# EAGLE design av_sync (EAGLE 5.11)
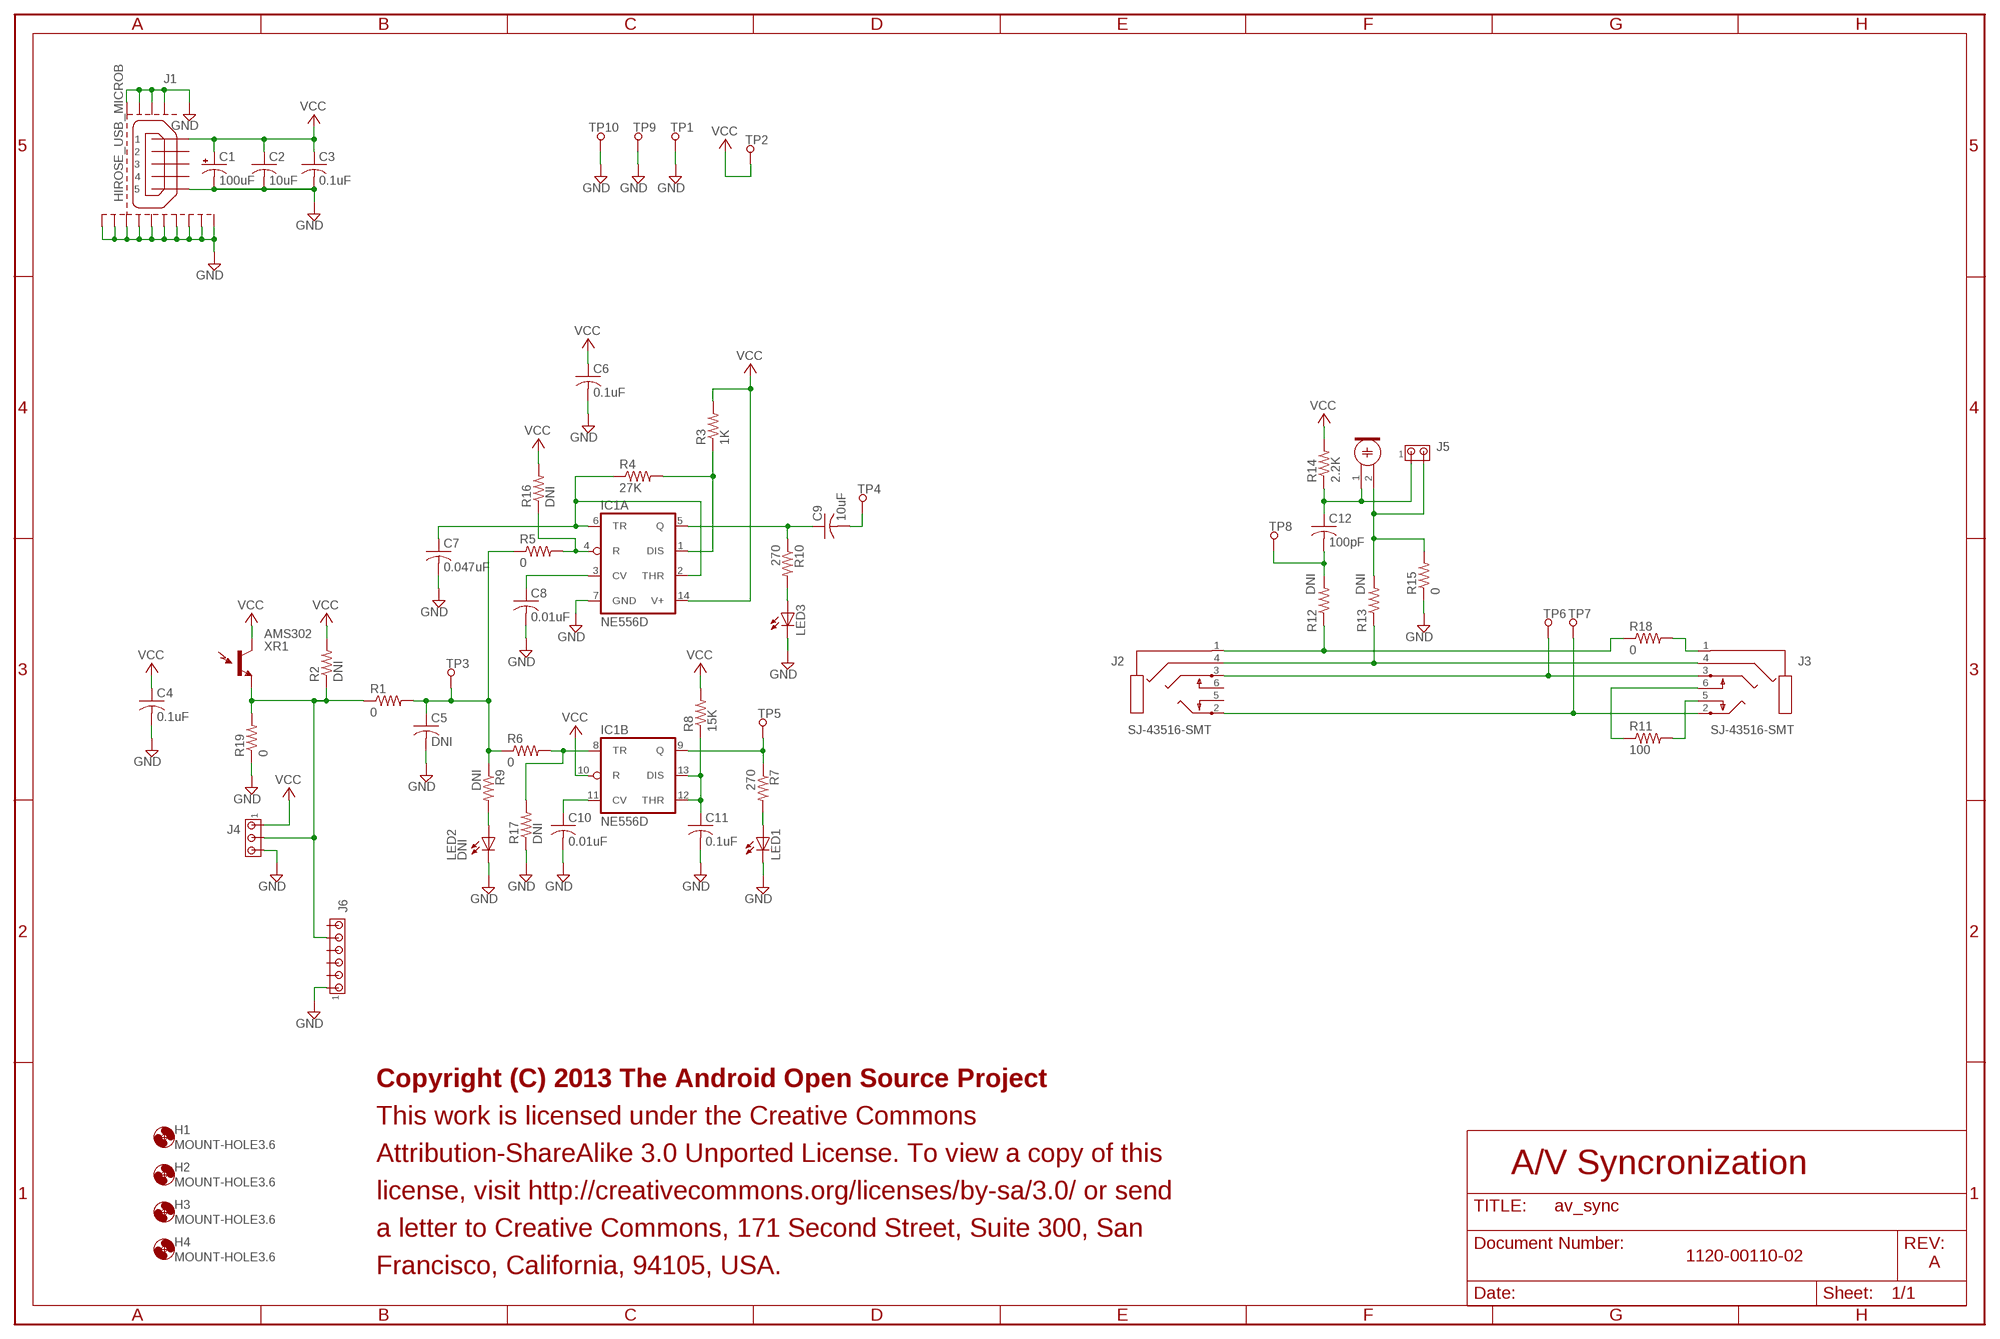
[diagram p0: schematic, sheet 1]

## Parts
C1  100uF  CPOL-USE2-5  [E2-5]
C2  10uF  C-US025-024X044  [C025-024X044]
C3  0.1uF  C-USC0805  [C0805]
C4  0.1uF  C-USC0805  [C0805]
C5  DNI  C-USC0805  [C0805]
C6  0.1uF  C-USC0805  [C0805]
C7  0.047uF  C-USC0805  [C0805]
C8  0.01uF  C-USC0805  [C0805]
C9  10uF  C-US025-024X044  [C025-024X044]
C10  0.01uF  C-USC0805  [C0805]
C11  0.1uF  C-USC0805  [C0805]
C12  100pF  C-USC0805  [C0805]
H1  MOUNT-HOLE3.6  [3,6]
H2  MOUNT-HOLE3.6  [3,6]
H3  MOUNT-HOLE3.6  [3,6]
H4  MOUNT-HOLE3.6  [3,6]
IC1  NE556D  [SO14]
J1  HIROSE_USB_MICROB  [HIROSE_ZX62D-B-5P8]
J2  SJ-43516-SMT  [SJ-4351X-SMT]
J3  SJ-43516-SMT  [SJ-4351X-SMT]
J4  MTA03-100  [10X03MTA]
J5  MTA02-100  [10X02MTA]
J6  MTA06-100  [10X06MTA]
LED1  LED5MM  [LED5MM]
LED2  DNI  LED5MM  [LED5MM]
LED3  LED5MM  [LED5MM]
M1  ELECTRET_MICROPHON-F6035AP  [F6035AP]
R1  0  R-US_R0805  [R0805]
R2  DNI  R-US_R0805  [R0805]
R3  1K  R-US_R0805  [R0805]
R4  27K  R-US_R0805  [R0805]
R5  0  R-US_R0805  [R0805]
R6  0  R-US_R0805  [R0805]
R7  270  R-US_R0805  [R0805]
R8  15K  R-US_R0805  [R0805]
R9  DNI  R-US_R0805  [R0805]
R10  270  R-US_R0805  [R0805]
R11  100  R-US_R0805  [R0805]
R12  DNI  R-US_R0805  [R0805]
R13  DNI  R-US_R0805  [R0805]
R14  2.2K  R-US_R0805  [R0805]
R15  0  R-US_R0805  [R0805]
R16  DNI  R-US_R0805  [R0805]
R17  DNI  R-US_R0805  [R0805]
R18  0  R-US_R0805  [R0805]
R19  0  R-US_R0805  [R0805]
TP1  5001  TP40MIL  [TP40MIL]
TP2  5000  TP40MIL  [TP40MIL]
TP3  5002  TP40MIL  [TP40MIL]
TP4  5115  TP40MIL  [TP40MIL]
TP5  5116  TP40MIL  [TP40MIL]
TP6  5003  TP40MIL  [TP40MIL]
TP7  5004  TP40MIL  [TP40MIL]
TP8  5117  TP40MIL  [TP40MIL]
TP9  5001  TP40MIL  [TP40MIL]
TP10  5001  TP40MIL  [TP40MIL]
XR1  AMS302  [AMS302]

## Nets
GND: C1.- C2.2 C3.2 C4.2 C5.2 C6.2 C7.2 C8.2 C10.2 C11.2 IC1.7(A:GND) J1.5 J1.M1(GND1) J1.M2(GND2) J1.M3(GND3) J1.M4(GND4) J1.M5(GND5) J1.M6(GND6) J1.M7(GND7) J1.M8(GND8) J1.M9(GND9) J1.M10(GND10) J1.M11(GND11) J1.M12(GND12) J1.P$1(GND13) J1.P$2(GND14) J4.3 J6.6 LED1.K(C) LED2.K(C) LED3.K(C) R15.1 R17.1 R19.1 TP1.1 TP9.1 TP10.1
N$1: J4.2 J6.2 R1.1 R2.1 R19.2 XR1.P$2(E1)
N$2: C5.1 R1.2 R5.1 R6.1 R9.1 TP3.1
N$3: IC1.1(A:DIS) R3.1 R4.2
N$4: C7.1 IC1.2(A:THR) IC1.6(A:TR) R4.1
N$5: IC1.8(B:TR) R6.2 R17.2
N$6: C10.1 IC1.11(B:CV)
N$7: C8.1 IC1.3(A:CV)
N$8: IC1.4(A:R) R5.2 R16.1
N$9: C9.1 IC1.5(A:Q) R10.1
N$10: C9.2 TP4.1
N$11: C11.1 IC1.12(B:THR) IC1.13(B:DIS) R8.1
N$12: IC1.9(B:Q) R7.1 TP5.1
N$13: LED1.A R7.2
N$14: J2.1 R12.1 R18.1
N$15: J2.2 J3.2 TP7.1
N$16: LED2.A R9.2
N$17: LED3.A R10.2
N$18: J2.4 J3.4 R13.1
N$19: J2.3 J3.3 TP6.1
N$20: J3.6 R11.1
N$21: J3.5 R11.2
N$22: C12.1 J5.1 M1.1 R14.1
N$23: J5.2 M1.2 R13.2 R15.2
N$24: C12.2 R12.2 TP8.1
N$25: J3.1 R18.2
VCC: C1.+ C2.1 C3.1 C4.1 C6.1 IC1.10(B:R) IC1.14(A:V+) J1.1 J4.1 R2.2 R3.2 R8.2 R14.2 R16.2 TP2.1 XR1.P$1(C1)
Unconnected: J1.2 J1.3 J1.4 J2.5 J2.6 J6.1 J6.3 J6.4 J6.5

## Notes on the sheet
- Copyright (C) 2013 The Android Open Source Project
- This work is licensed under the Creative Commons
- Attribution-ShareAlike 3.0 Unported License. To view a copy of this
- A/V Syncronization
- license, visit http://creativecommons.org/licenses/by-sa/3.0/ or send
- a letter to Creative Commons, 171 Second Street, Suite 300, San
- 1120-00110-02
- A
- Francisco, California, 94105, USA.

## Library data of the parts
C1 = rcl:CPOL-US: POLARIZED CAPACITOR, American symbol
C2-C12 = rcl:C-US: CAPACITOR, American symbol
H1-H4 = holes:MOUNT-HOLE: MOUNTING HOLE with drill center marker
IC1 = linear:*556: Dual TIMER
J1 = con-misc:HIROSE_USB_MICROB: Hirose USB Micro B (Bottom mount, shell through hole)
J2 J3 = bibaja:SJ-43516-SMT
J4 = con-amp:MTA03-100: AMP connector; OC_FARNELL: unknown; OC_NEWARK: unknown
J5 = con-amp:MTA02-100: AMP connector; OC_FARNELL: unknown; OC_NEWARK: unknown
J6 = con-amp:MTA06-100: AMP connector; OC_FARNELL: unknown; OC_NEWARK: unknown
LED1-LED3 = led:LED: LED OSRAM: - CHIPLED LG R971, LG N971, LY N971, LG Q971, LY Q971, LO R971, LY R971 LH N974, LH R974 LS Q976, LO Q976, LY Q976 LO Q996 - Hyper CHIPLED LW Q18S LB Q993, LB Q99A, LB R99A - SideLED LS A670, LO A670, LY A670, LG A670, LP A670 LB A673, LV A673, LT A673, LW A673 LH A674 LY A675 LS A676, LA A676, LO A676, LY A676, LW A676 LS A679, LY A679, LG A679 - Hyper Micro SIDELED® LS Y876, LA Y876, LO Y876, LY Y876 LT Y87S - SmartLED LW L88C, LW L88S LB L89C, LB L89S, LG L890 LS L89K, LO L89K, LY L89K LS L896, LA L896, LO L896, LY L896 - TOPLED LS T670, LO T670, LY T670, LG T670, LP T670 LSG T670, LSP T670, LSY T670, LOP T670, LYG T670 LG T671, LOG T671, LSG T671 LB T673, LV T673, LT T673, LW T673 LH T674 LS T676, LA T676, LO T676, LY T676, LB T676, LH T676, LSB T676, LW T676 LB T67C, LV T67C, LT T67C, LS T67K, LO T67K, LY T67K, LW E67C LS E67B, LA E67B, LO E67B, LY E67B, LB E67C, LV E67C, LT E67C LW T67C LS T679, LY T679, LG T679 LS T770, LO T770, LY T770, LG T770, LP T770 LB T773, LV T773, LT T773, LW T773 LH T774 LS E675, LA E675, LY E675, LS T675 LS T776, LA T776, LO T776, LY T776, LB T776 LHGB T686 LT T68C, LB T68C - Hyper Mini TOPLED® LB M676 - Mini TOPLED Santana® LG M470 LS M47K, LO M47K, LY M47K Source: http://www.osram.convergy.de LUXEON: - LUMILED® LXK2-PW12-R00, LXK2-PW12-S00, LXK2-PW14-U00, LXK2-PW14-V00 LXK2-PM12-R00, LXK2-PM12-S00, LXK2-PM14-U00 LXK2-PE12-Q00, LXK2-PE12-R00, LXK2-PE12-S00, LXK2-PE14-T00, LXK2-PE14-U00 LXK2-PB12-K00, LXK2-PB12-L00, LXK2-PB12-M00, LXK2-PB14-N00, LXK2-PB14-P00, LXK2-PB14-Q00 LXK2-PR12-L00, LXK2-PR12-M00, LXK2-PR14-Q00, LXK2-PR14-R00 LXK2-PD12-Q00, LXK2-PD12-R00, LXK2-PD12-S00 LXK2-PH12-R00, LXK2-PH12-S00 LXK2-PL12-P00, LXK2-PL12-Q00, LXK2-PL12-R00 Source: www.luxeon.com KINGBRIGHT: KA-3528ASYC Source: www.kingbright.com
M1 = microphon:ELECTRET_MICROPHON-: Electret Condenser Microphone
R1-R19 = rcl:R-US_: RESISTOR, American symbol
TP1-TP10 = bibaja:TP*: Test point
XR1 = troy:AMS302: Panasonic AMS302 Light Sensor Light sensor for AV sync test board.

## Board
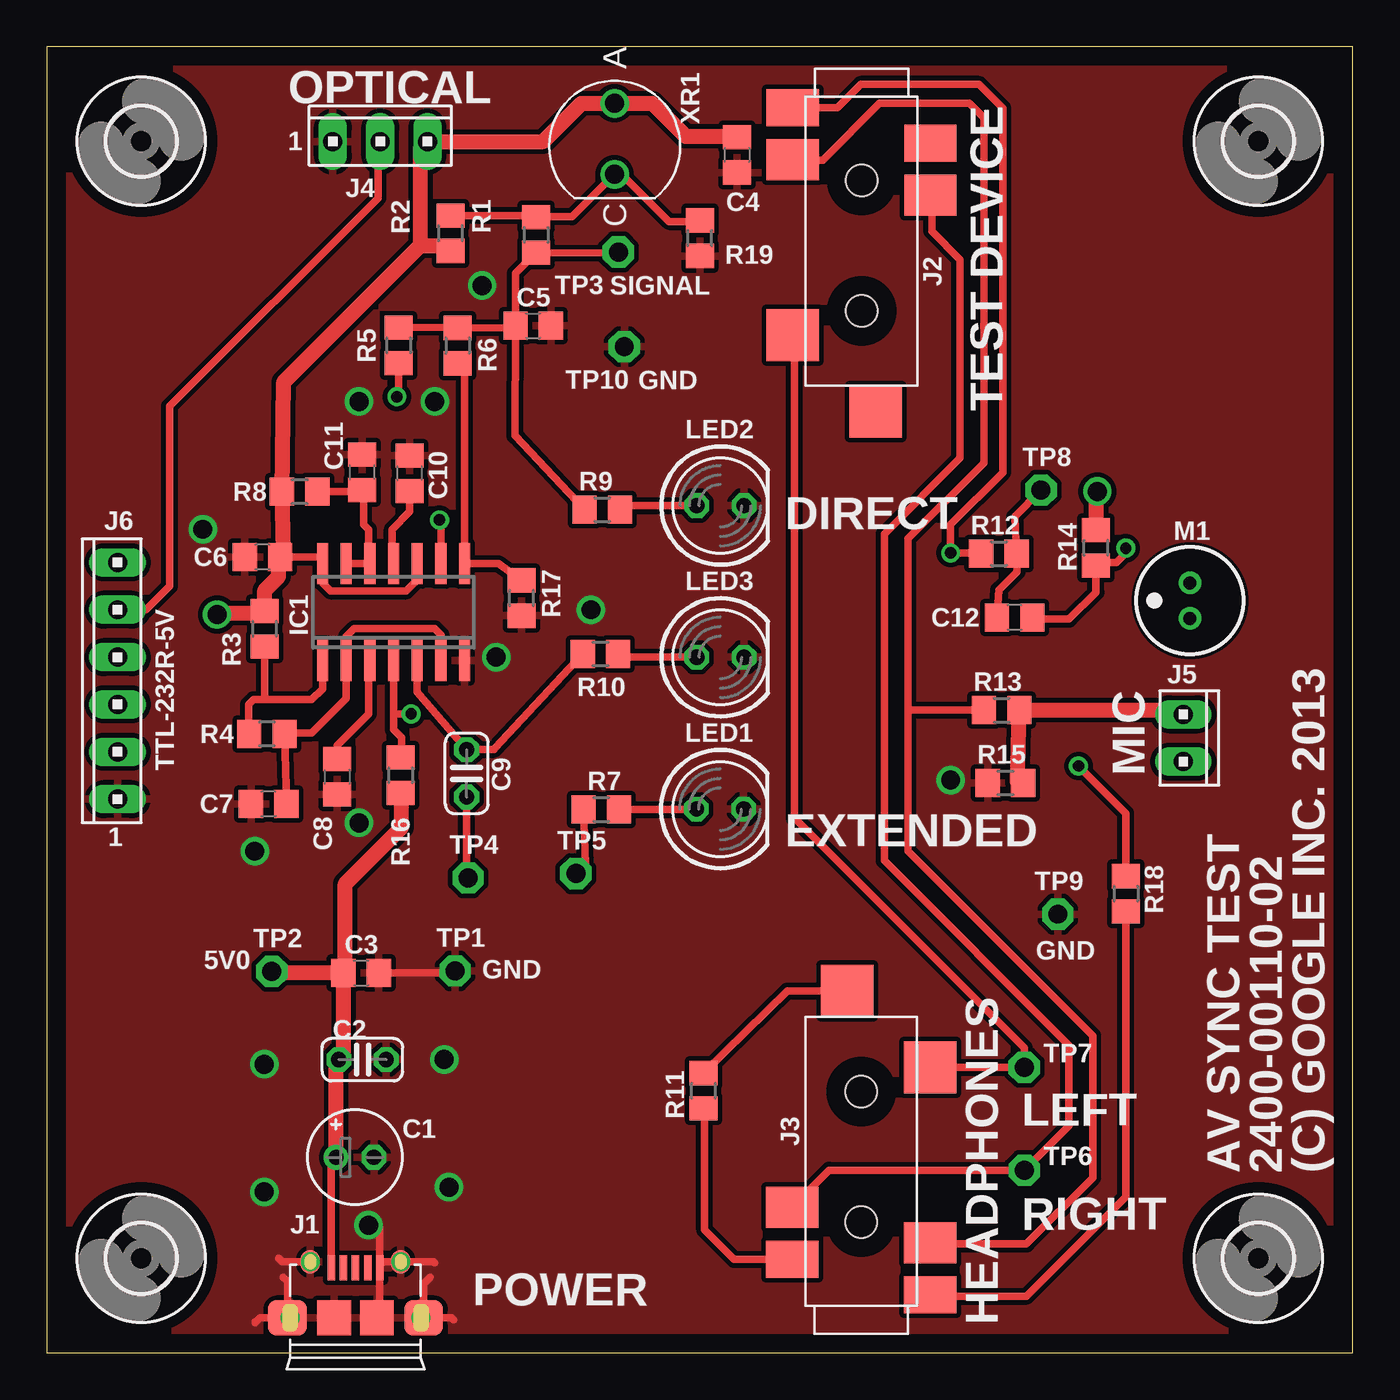
[diagram p1: board, top side]
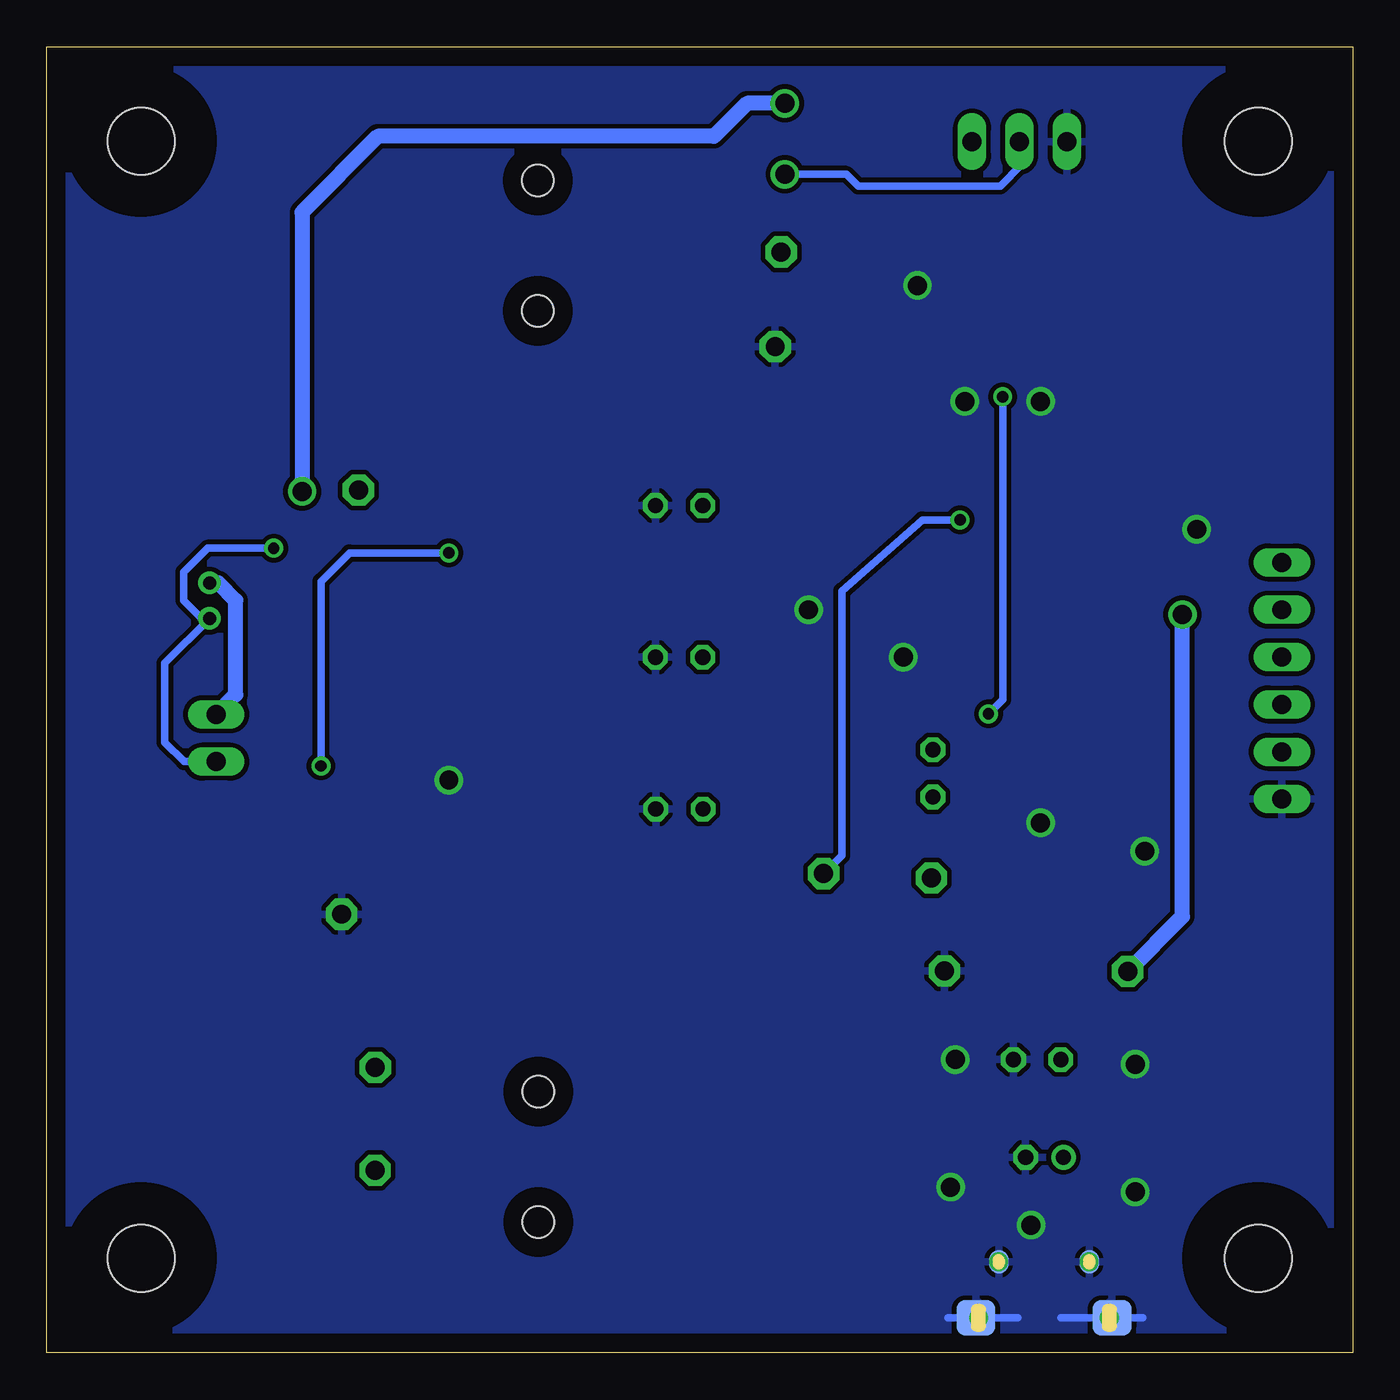
[diagram p2: board, bottom side, seen from below]

Size 70.1 x 70.1 mm. Coordinates in mm from the lower left corner, seen from the top.
Outline: 0,0 70.1,0 70.1,70.1 0,70.1 0,0
Copper layers (1*16): Top 0.035mm / dielectric 1.5mm / Bottom 0.035mm
Design rules "default *": minimum track width 10mil, minimum drill 24mil, track to track 10mil, track to pad 10mil, pad to pad 10mil, via to via 10mil, smd to smd 10mil, copper to edge 40mil, drill to drill 10mil, minimum pad ring 10mil, minimum via ring 8mil, stop-mask expansion 4mil, vias tented up to drill 0mil, thermal gap 10mil
Holes 0.25 mm at 1.07,-29.98
Holes 0.61 mm at 1.07,-35.06
Holes 0.7 mm at 1.07,-40.14
Holes 0.81 mm at 1.07,-45.22
Holes 1.02 mm at 1.07,-50.3
Holes 1.7 mm at 1.07,-55.38
Holes 3.6 mm at 1.07,-60.46

### Footprints (pad centres in the part's own frame; a part is rotated, then mirrored left to right if it is on the bottom)
E2-5 = drill 0.813 pad 1.27 round: + -1.016,0 | drill 0.813 pad 1.27 octagon: - 1.016,0
C025-024X044 = drill 0.813 octagon: 1 -1.27,0; 2 1.27,0
C0805 = smd 1.3 x 1.5: 1 -0.95,0; 2 0.95,0
3,6 = hole 3.6: 0,0
SO14 = smd 0.6 x 2.2: 1 -3.81,-2.6; 2 -2.54,-2.6; 3 -1.27,-2.6; 4 0,-2.6; 5 1.27,-2.6; 6 2.54,-2.6; 7 3.81,-2.6; 8 3.81,2.6; 9 2.54,2.6; 10 1.27,2.6; 11 0,2.6; 12 -1.27,2.6; 13 -2.54,2.6; 14 -3.81,2.6
HIROSE_ZX62D-B-5P8 = smd 0.4 x 1.35: 1 -1.3,2.675; 2 -0.65,2.675; 3 0,2.675; 4 0.65,2.675; 5 1.3,2.675 | smd 1.05 x 1.25 bottom: M1 -2.425,3; M2 2.425,3 | smd 2.1 x 1.9 bottom: M3 -3.65,0; M4 3.65,0 | smd 1.05 x 1.25: M5 -2.425,3; M6 2.425,3 | smd 2.1 x 1.9: M7 -3.65,0; M8 3.65,0 | smd 1.8 x 1.9: M9 -1.15,0; M10 1.15,0 | drill 0.254 pad 1 round: M11 -2.425,3; M12 2.425,3; P$1 -3.513,0; P$2 3.513,0
SJ-4351X-SMT = smd 2 x 2.8: 1 0.6,-3.7; 6 2.5,3.7 | smd 2.8 x 2.8: 2 12.8,-3.7; 5 16.9,0.75 | smd 2.2 x 2.8: 3 5.3,3.7; 4 3.4,-3.7 | hole 1.7: 4.5,0; 11.5,0
10X03MTA = drill 1.016 long: 1 2.54,0; 2 0,0; 3 -2.54,0
10X02MTA = drill 1.016 long: 1 1.27,0; 2 -1.27,0
10X06MTA = drill 1.016 long: 1 6.35,0; 2 3.81,0; 3 1.27,0; 4 -1.27,0; 5 -3.81,0; 6 -6.35,0
LED5MM = drill 0.813 octagon: A -1.27,0; K 1.27,0
F6035AP = drill 0.7 pad 1.2 round: 1 0,0.95; 2 0,-0.95
R0805 = smd 1.3 x 1.5: 1 -0.95,0; 2 0.95,0
TP40MIL = drill 1.016 pad 1.676 octagon: 1 0,0
AMS302 = drill 1.016 round: P$1 1.905,0; P$2 -1.905,0

### Placement (x,y rotation side)
C1  16.55,10.5 0 top
C2  16.95,15.74 0 top
C3  16.88,20.39 0 top
C4  37.05,64.29 270 top
C5  26.11,55.12 0 top
C6  11.59,42.71 180 top
C7  11.92,29.46 180 top
C8  15.59,30.92 270 top
C9  22.54,31.1 270 top
C10  19.49,47.2 90 top
C11  16.94,47.25 90 top
C12  51.95,39.46 180 top
H1  5.08,65.02 0 top
H2  5.08,5.08 0 top
H3  65.02,5.08 0 top
H4  65.02,65.02 0 top
IC1  18.62,39.75 0 top
J1  16.58,1.89 0 top
J2  43.74,67.42 270 top
J3  43.71,2.52 90 top
J4  17.9,65 0 top
J5  61,33 270 top
J6  3.81,36.07 90 top
LED1  36.14,29.19 0 top
LED2  36.16,45.47 0 top
LED3  36.16,37.33 0 top
M1  61.35,40.37 180 top
R1  26.26,59.99 270 top
R2  21.67,60.08 270 top
R3  11.71,38.86 90 top
R4  11.82,33.21 180 top
R5  18.89,54.06 270 top
R6  22.06,54.05 270 top
R7  29.77,29.16 0 top
R8  13.58,46.21 180 top
R9  29.82,45.25 0 top
R10  29.72,37.51 0 top
R11  35.25,14.07 90 top
R12  51.1,42.89 0 top
R13  51.25,34.49 0 top
R14  56.31,43.2 90 top
R15  51.45,30.59 0 top
R16  19,31 270 top
R17  25.49,40.51 90 top
R18  57.91,24.64 270 top
R19  35.05,59.82 90 top
TP1  21.92,20.5 0 top
TP2  12.09,20.47 0 top
TP3  30.68,59.08 0 top
TP4  22.62,25.49 0 top
TP5  28.4,25.72 0 top
TP6  52.47,9.8 0 top
TP7  52.46,15.32 0 top
TP8  53.37,46.3 0 top
TP9  54.27,23.54 0 top
TP10  31,54 0 top
U$1  [A3L-LOC]  -71.37,-103.89 0 top  (outside the outline)
XR1  30.48,65.15 90 top

### Tracks (layer width: path | path; a pad name or v marks a point on that pad's centre or on a via)
GND  (via drill 1.02)
  Top 0.406: C3.2 21.81,20.39 TP1.1 | 17.88,6.7 J1.5 17.88,1.89 J1.M10 | C10.2 19.49,47.94 | C11.2 17.02,48.18 | J1.M7 11.47,1.89 11.2,1.62 11.2,1.66 | J1.M7 J1.P$1 | J1.M11 12.64,4.89 12.45,5.08 | J1.M7 12.93,3.83 12.7,4.06 | J1.M9 15.68,1.89 | 21.84,1.78 21.74,1.89 J1.M8 20.23,3.72 20.57,4.06 | 20.83,4.83 20.77,4.89 J1.M12 18.09,4.89 18.03,4.83
  Bottom 0.406: v48.51,30.73 48.51,31.24 | 11.28,1.89 J1.M7 15.68,1.89 | J1.P$2 17.98,1.89 | J1.M8 21.74,1.89
  other vias: 21.34,15.75 17.27,6.86 24.13,37.34 29.21,39.88 11.18,26.92 16.76,28.45 8.38,44.2 20.83,51.05 16.76,51.05 21.59,8.89 11.68,8.64 11.68,15.49 23.37,57.28
  pour Bottom: 0,0 70,0 70,70 0,70
  pour Top: 70.1,0 70.1,70.1 0,70.1 0,0
N$1
  Top 0.406: 18.03,65.13 J4.2 17.78,64.88 17.78,61.98 6.6,50.8 6.6,41.15 5.33,39.88 J6.2 | R2.1 21.62,60.93 | R2.1 21.7,60.96 | R1.1 26.24,60.96 28.19,60.96 XR1.P$2 30.86,63.25 33.4,60.71 34.99,60.71 R19.2 | R1.1 26.28,60.96 | R2.1 26.17,61.03 R1.1
  Bottom 0.406: XR1.P$2 27.18,63.25 26.54,62.61 18.92,62.61 17.78,63.75 17.78,64.88 J4.2
N$2
  Top 0.406: C5.1 25.17,55.03 R6.1 22.05,55.04 R5.1 | TP3.1 30.62,59.01 R1.2 25.16,57.94 C5.1 | R9.1 25.13,49.21 C5.1
N$3
  Top 0.406: IC1.1 14.81,35.64 14.22,35.05 11.68,35.05 | 11.68,35.05 11.11,35.05 10.84,34.79 10.84,33.24 R4.2 | R3.1 11.71,35.08 11.68,35.05
N$4
  Top 0.406: IC1.6 21.16,38.53 20.83,38.86 16.51,38.86 16.08,38.43 IC1.2 16.08,35.13 14.22,33.27 12.73,33.27 R4.1 12.77,33.11 C7.1
N$5
  Top 0.406: R17.2 24.25,42.35 IC1.8 22.43,52.83 R6.2
N$6
  Top 0.406: C10.1 19.49,45.14 18.54,44.2 18.54,42.68 IC1.11
N$7
  Top 0.406: C8.1 15.59,32.61 17.27,34.29 17.27,36.82 IC1.3
N$8  (via drill 0.61)
  Top 0.406: 18.62,34.29 18.62,33.45 19.05,33.02 19.05,31.9 R16.1 | 18.62,34.29 IC1.4 | R5.2 18.89,51.4 v18.8,51.31 | 18.62,34.29 v19.56,34.29
  Bottom 0.406: v18.8,51.31 18.8,35.05 v19.56,34.29
N$9
  Top 0.406: IC1.5 19.89,35.47 C9.1 22.55,32.38 24,32.38 24.05,32.43 R10.1
N$10
  Top 0.406: C9.2 22.54,25.57 TP4.1
N$11
  Top 0.406: 17,46.21 R8.1 | IC1.13 IC1.12 17.27,42.68 17.27,44.2 17,44.46 17,46.21 | 17,46.21 17,46.34 C11.1
N$12  (via drill 0.61)
  Top 0.406: R7.1 28.92,26.24 TP5.1 | IC1.9 21.16,44.63 v21.08,44.7
  Bottom 0.406: v21.08,44.7 23.11,44.7 27.43,40.89 27.43,26.69 TP5.1
N$13
  Top 0.406: R7.2 34.84,29.16 LED1.A
N$14  (via drill 0.61)
  Top 0.406: v55.37,31.5 57.91,28.96 R18.1 | R12.1 50.21,42.93 v48.51,42.93 48.51,44.45 51.31,47.24 51.31,66.8 50.04,68.07 43.69,68.07 42.43,66.82 J2.1
  Bottom 0.406: v55.37,31.5 55.37,41.4 53.85,42.93 v48.51,42.93
N$15
  Top 0.406: J3.2 TP7.1 52.46,16.37 40.13,28.7 40.13,54.52 J2.2
N$16
  Top 0.406: LED2.A 30.89,45.47 R9.2
N$17
  Top 0.406: LED3.A 30.75,37.33 R10.2
N$18
  Top 0.406: J3.4 47.33,5.84 52.58,5.84 56.13,9.4 56.13,17.02 46.23,26.92 46.23,34.54 | 46.23,34.54 46.23,43.69 50.29,47.75 50.29,66.29 49.53,67.06 44.7,67.06 41.66,64.01 40.05,64.01 J2.4 40.28,64.26 | R13.1 46.28,34.49 46.23,34.54
N$19
  Top 0.406: J3.3 41.99,9.8 TP6.1 54.86,12.19 54.86,16.51 44.96,26.42 44.96,43.94 49.02,48.01 49.02,58.67 47.5,60.2 47.5,62.06 J2.3
N$20
  Top 0.406: J3.6 36.89,5.02 35.31,6.6 35.31,13.16 R11.1
N$21
  Top 0.406: R11.2 39.75,19.42 J3.5
N$22  (via drill 0.61)
  Top 0.406: C12.1 52.71,39.37 54.86,39.37 56.31,40.82 R14.1 56.38,42.42 57.4,42.42 57.91,42.93 v57.91,43.18
  Bottom 0.406: v57.91,43.18 61.47,43.18 62.74,41.91 62.74,40.39 61.77,39.42 M1.1 63.75,37.02 63.75,32.77 62.72,31.73 J5.1
N$23
  Top 0.406: R15.2 52.1,30.59 | 60.78,34.49 J5.2
  Top 0.813: 52.1,30.59 R13.2 60.78,34.49
  Bottom 0.813: M1.2 60.88,41.32 59.94,40.39 59.94,35.33 J5.2
N$24
  Top 0.406: C12.2 51.1,40.94 52.07,41.91 52.07,42.77 R12.2 51.95,44.88 TP8.1
N$25
  Top 0.406: R18.2 57.91,8.38 52.58,3.05 47.48,3.05 J3.1
VCC  (via drill 1.02)
  Top 0.406: J1.1 15.28,10.24 C1.+ | 15.53,15.44 C2.1 | 12.45,42.7 C6.1 14.7,42.71 IC1.14 14.81,41.32 15.24,40.89 19.3,40.89 19.81,41.4 19.81,42.53 IC1.10 | 19.05,30.2 R16.2 | 12.17,20.39 TP2.1 | v9.14,39.62 9.23,39.71 | 11.71,39.71 R3.2
  Top 0.813: C1.+ 15.53,15.44 | C6.1 12.73,43 R8.2 12.73,52.1 20.07,59.44 | R3.2 11.71,40.92 12.45,41.66 12.45,42.7 | 19.05,30.2 19.05,28.19 16.03,25.17 16.03,20.49 C3.1 | C3.1 12.17,20.39 | 20.07,59.44 20.07,64.63 J4.1 26.65,65 28.7,67.06 XR1.P$1 32.51,67.06 34.29,65.28 36.57,65.28 C4.1 | 20.07,59.44 20.1,59.41 21.59,59.41 21.59,59.31 R2.2 | R14.2 56.31,46.15 v56.39,46.23 | TP2.1 | 9.23,39.71 11.71,39.71 | C3.1 15.93,15.99 C2.1
  Bottom 0.813: v9.14,39.62 9.14,23.41 TP2.1 | v56.39,46.23 56.39,61.21 52.32,65.28 34.29,65.28 32.51,67.06 XR1.P$1

### Text on the board
Top: Top | 2
Bottom: Bottom | 3
tPlace: OPTICAL | 1 | SIGNAL | GND | TEST DEVICE | DIRECT | TTL-232R-5V | MIC | 1 | EXTENDED | 5V0 | GND | GND | LEFT | AV SYNC TEST | 2400-00110-02 | (C) GOOGLE INC. 2013 | RIGHT | POWER | HEADPHONES
Holes: DRILL PLAN | SYM | SIZE | TOL. | CNT | PLATE | 0.010 in | +/-0.005 in | 4 | Yes | 0.024 in | +/-0.005 in | 6 | Yes | 0.028 in | +/-0.005 in | 2 | Yes | 0.032 in | +/-0.005 in | 12 | Yes | 0.040 in | +/-0.005 in | 39 | Yes | 0.067 in | +/-0.005 in | 4 | No | 0.142 in | +/-0.005 in | 4 | No | TOTAL | 71 | 63 | Drill file will contain one extra of | each drill, placed in above diagram. | Drills and Milling | 4
Measures: 0.00 | 2.76 | 2.76 | 0.00
Document: Copyright (C) 2013 The Android Open Source Project | This work is licensed under the Creative Commons | Attribution-ShareAlike 3.0 Unported License. To view a copy of this | license, visit http://creativecommons.org/licenses/by-sa/3.0/ or send | a letter to Creative Commons, 171 Second Street, Suite 300, San | Francisco, California, 94105, USA. | (C) 2012 Google, Inc. | 2400-00110-02 REV A | CONFIDENTIAL | of 4
Reference: Notes: | 1. Unplated holes may be plated. | 2. Soldermask both sides with green LPI | 3. Silkscreen top in white | 4. 2 Layer PCB with 1oz finished copper thickness | 5. Finish to be HASL or equivalent | Notes | 1